# Altium schematic sheet ethernet.SchDoc
size A
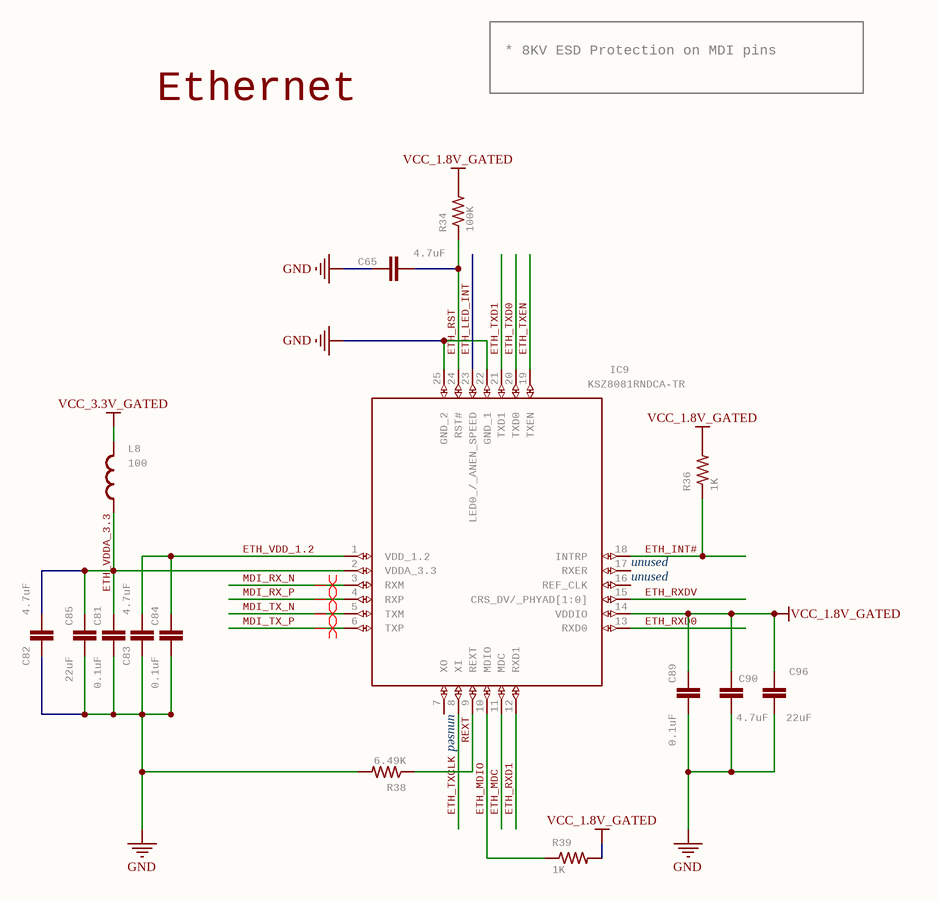
[diagram p0: ethernet.SchDoc]

## Parts
C65  4.7uF  [0402-CAP]
C81  0.1uF  [0402-CAP]
C82  4.7uF  [0402-CAP]
C83  4.7uF  [0402-CAP]
C84  0.1uF  [0402-CAP]
C85  22uF  [0805]
C89  0.1uF  [0402-CAP]
C90  4.7uF  [0402-CAP]
C96  22uF  [0805]
IC9  KSZ8081RNDCA-TR  [QFN50P400X400X90-25N]
L8  100  [C0402]
R34  100K  [0402-RES]
R36  1K  [0402-RES]
R38  6.49K  [0402-RES]
R39  1K  [0402-RES]

## Nets
GND: C65.1 C81.2 C82.1 C83.1 C84.2 C85.2 C89.2 C90.1 C96.2 IC9.22(GND_1) IC9.25(GND_2) R38.2
VCC_1.8V_GATED: C89.1 C90.2 C96.1 IC9.14(VDDIO) R34.2 R36.2 R39.2
VCC_3.3V_GATED: L8.2
ETH_INT#: IC9.18(INTRP) R36.1
ETH_LED_INT: IC9.23(LED0_/_ANEN_SPEED)
ETH_MDC: IC9.11(MDC)
ETH_MDIO: IC9.10(MDIO) R39.1
ETH_RST: C65.2 IC9.24(RST#) R34.1
ETH_RXD0: IC9.13(RXD0)
ETH_RXD1: IC9.12(RXD1)
ETH_RXDV: IC9.15(CRS_DV/_PHYAD[1:0])
ETH_TXCLK: IC9.8(XI)
ETH_TXD0: IC9.20(TXD0)
ETH_TXD1: IC9.21(TXD1)
ETH_TXEN: IC9.19(TXEN)
ETH_VDD_1.2: C83.2 C84.1 IC9.1(VDD_1.2)
ETH_VDDA_3.3: C81.1 C82.2 C85.1 IC9.2(VDDA_3.3) L8.1
MDI_RX_N: IC9.3(RXM)
MDI_RX_P: IC9.4(RXP)
MDI_TX_N: IC9.5(TXM)
MDI_TX_P: IC9.6(TXP)
REXT: IC9.9(REXT) R38.1

Not connected (* = marked no-connect by the designer): IC9 7(XO) 16(REF_CLK) 17(RXER)

## Layout directives
differential pair: MDI_RX_N, MDI_RX_P, MDI_TX_N, MDI_TX_P

## Notes on the sheet
- Ethernet
- * 8KV ESD Protection on MDI pins
- (near IC9) unused
- unused

## Library data of the parts
C65 C82 C83 C90 = CAP0402-CAP: CapacitorStandard 0603 ceramic capacitor, and 0.1" leaded capacitor.; MPN: JMK105BBJ475MV-F; GateName_1: G$1; SymbolName_1: CAP; DeviceName: 0402-CAP; LibraryName: sfe; DeviceSetName: CAP; Part Number: JMK105BBJ475MV-F
C81 C84 C89 = C-EUC0201: CAPACITOR, European symbol; MPN: C0402C104Z4VAC; GateName_1: G$1; SymbolName_1: C-EU; POPULARITY: 0; LibraryName: rcl; DeviceSetName: C-EU; SPICEPREFIX: C; Part Number: C0402C104Z4VAC
C85 C96 = 22UF-0805-6.3V-20%: 22ÂµF ceramic capacitors    A capacitor is a passive two-terminal electrical component used to store electrical energy temporarily in an electric field.; MPN: CL21A226MQQNNNE; GateName_1: G$1; SymbolName_1: CAP; PROD_ID: CAP-08402; DeviceName: -0805-6.3V-20%; LibraryName: SparkFun-Capacitors; DeviceSetName: 22UF; Part Number: CL21A226MQQNNNE
IC9 = KSZ8081RNDCA-TR: Ethernet ICs 10/100 BASE-TX Physical Layer Transceiver   Source:  Datasheet; MANUFACTURER_NAME: Microchip; GateName_1: G$1; SymbolName_1: KSZ8081RNDCA-TR; LibraryName: KSZ8081RNDCA-TR; DeviceSetName: KSZ8081RNDCA-TR; HEIGHT: 0.9mm; MANUFACTURER_PART_NUMBER: KSZ8081RNDCA-TR; MOUSER_PART_NUMBER: 998-KSZ8081RNDCATR; MOUSER_PRICE-STOCK: https://www.mouser.co.uk/ProductDetail/Microchip-Technology-Atmel/KSZ8081RNDCA-TR?qs=U6T8BxXiZAXLXXdn%2FieQKw%3D%3D; MPN: KSZ8081RNDCA-TR; Part Number: KSZ8081RNDCA-TR
L8 = INDUCTOR0402: InductorsBasic Inductor/Choke - 0603 and 1206. Footprints are not proven and vary greatly between part numbers.; MPN: MFBM1V1005-101-R; GateName_1: G$1; DeviceName: 0402; SymbolName_1: INDUCTOR; LibraryName: sfe; DeviceSetName: INDUCTOR; Part Number: MFBM1V1005-101-R
R34 = RESISTOR0402-RES: ResistorBasic schematic elements and footprints for 0603, 1206, and PTH resistors.; MPN: AC0402FR-07100KL; GateName_1: G$1; SymbolName_1: RESISTOR; DeviceName: 0402-RES; LibraryName: sfe; DeviceSetName: RESISTOR; Part Number: AC0402FR-07100KL
R36 R39 = RESISTOR0402-RES: ResistorBasic schematic elements and footprints for 0603, 1206, and PTH resistors.; MPN: CRCW04021K00FKEDC; GateName_1: G$1; SymbolName_1: RESISTOR; DeviceName: 0402-RES; LibraryName: sfe; DeviceSetName: RESISTOR; Part Number: CRCW04021K00FKEDC
R38 = RESISTOR0402-RES: ResistorBasic schematic elements and footprints for 0603, 1206, and PTH resistors.; MPN: CR0402-FX-6491GLF; GateName_1: G$1; SymbolName_1: RESISTOR; DeviceName: 0402-RES; LibraryName: sfe; DeviceSetName: RESISTOR; Part Number: CR0402-FX-6491GLF